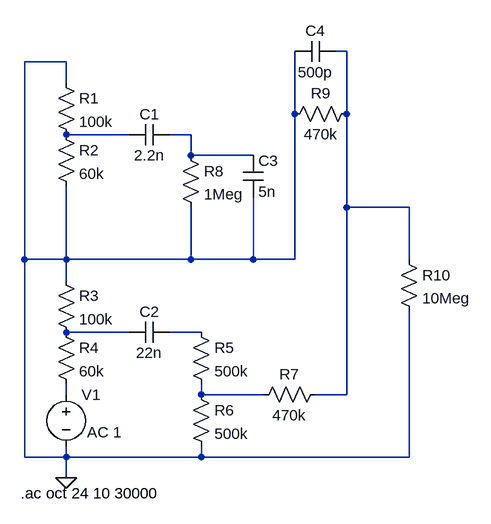
[diagram p0: schematic Draft1.asc]
Draft1.asc, the LTspice schematic file:
Version 4
SHEET 1 880 696
WIRE 560 0 544 0
WIRE 128 16 64 16
WIRE 128 48 128 16
WIRE 480 96 480 0
WIRE 560 96 560 0
WIRE 224 128 128 128
WIRE 320 128 288 128
WIRE 320 160 320 128
WIRE 416 160 320 160
WIRE 560 240 560 96
WIRE 656 240 560 240
WIRE 64 320 64 16
WIRE 128 320 128 208
WIRE 128 320 64 320
WIRE 320 320 320 240
WIRE 320 320 128 320
WIRE 416 320 416 224
WIRE 416 320 320 320
WIRE 480 320 480 96
WIRE 480 320 416 320
WIRE 656 320 656 240
WIRE 128 352 128 320
WIRE 224 432 128 432
WIRE 336 432 288 432
WIRE 128 528 128 512
WIRE 336 528 336 512
WIRE 432 528 336 528
WIRE 560 528 560 240
WIRE 560 528 512 528
WIRE 64 624 64 320
WIRE 128 624 128 608
WIRE 128 624 64 624
WIRE 336 624 336 608
WIRE 336 624 128 624
WIRE 656 624 656 400
WIRE 656 624 336 624
WIRE 128 656 128 624
FLAG 128 656 0
SYMBOL res 112 32 R0
SYMATTR InstName R1
SYMATTR Value 100k
SYMBOL res 112 112 R0
SYMATTR InstName R2
SYMATTR Value 60k
SYMBOL res 112 336 R0
SYMATTR InstName R3
SYMATTR Value 100k
SYMBOL res 112 416 R0
SYMATTR InstName R4
SYMATTR Value 60k
SYMBOL voltage 128 512 R0
WINDOW 123 32 74 Left 0
WINDOW 39 0 0 Left 0
SYMATTR InstName V1
SYMATTR Value ""
SYMATTR Value2 AC 1
SYMBOL cap 288 112 R90
WINDOW 0 0 32 VBottom 0
WINDOW 3 32 32 VTop 0
SYMATTR InstName C1
SYMATTR Value 2.2n
SYMBOL cap 288 416 R90
WINDOW 0 0 32 VBottom 0
WINDOW 3 32 32 VTop 0
SYMATTR InstName C2
SYMATTR Value 22n
SYMBOL res 320 416 R0
SYMATTR InstName R5
SYMATTR Value 500k
SYMBOL res 320 512 R0
SYMATTR InstName R6
SYMATTR Value 500k
SYMBOL res 528 512 R90
WINDOW 0 0 56 VBottom 0
WINDOW 3 32 56 VTop 0
SYMATTR InstName R7
SYMATTR Value 470k
SYMBOL res 304 144 R0
SYMATTR InstName R8
SYMATTR Value 1Meg
SYMBOL cap 400 160 R0
SYMATTR InstName C3
SYMATTR Value 5n
SYMBOL res 576 80 R90
WINDOW 0 0 56 VBottom 0
WINDOW 3 32 56 VTop 0
SYMATTR InstName R9
SYMATTR Value 470k
SYMBOL res 640 304 R0
SYMATTR InstName R10
SYMATTR Value 10Meg
SYMBOL cap 544 -16 R90
WINDOW 0 0 32 VBottom 0
WINDOW 3 32 32 VTop 0
SYMATTR InstName C4
SYMATTR Value 500p
TEXT 58 680 Left 0 !.ac oct 24 10 30000

The netlist it stands for:
* Draft1.asc
R1 0 N002 100k
R2 N002 0 60k
R3 0 N004 100k
R4 N004 N006 60k
V1 N006 0 AC 1
C1 N003 N002 2.2n
C2 N005 N004 22n
R5 N005 N007 500k
R6 N007 0 500k
R7 N001 N007 470k
R8 N003 0 1Meg
C3 N003 0 5n
R9 N001 0 470k
R10 N001 0 10Meg
C4 N001 0 500p
.ac oct 24 10 30000
.backanno
.end